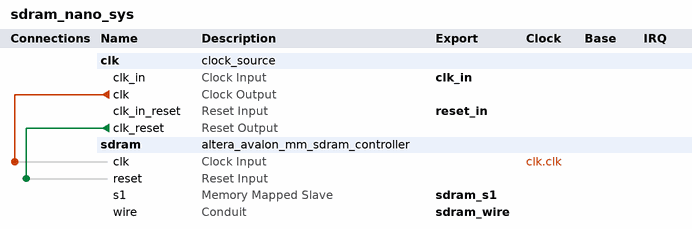
[diagram p0: system contents]
# Platform Designer (Qsys) system sdram_nano_sys, Cyclone IV E EP4CE22F17C6
# Parameters at their usual value, and those the tool derives, are not listed.
package require -exact qsys 18.1
create_system sdram_nano_sys
set_project_property DEVICE_FAMILY {Cyclone IV E}
set_project_property DEVICE EP4CE22F17C6

add_instance clk clock_source 18.1
set_instance_parameter_value clk clockFrequency 100000000
set_instance_parameter_value clk resetSynchronousEdges DEASSERT

add_instance sdram altera_avalon_mm_sdram_controller 1.0
set_instance_parameter_value sdram ADDR_MAP 0
set_instance_parameter_value sdram BANK_BITS 2
set_instance_parameter_value sdram CAS_LAT 3
set_instance_parameter_value sdram COL_BITS 9
set_instance_parameter_value sdram DATA_BITS 16
set_instance_parameter_value sdram FIFO_DEPTH 8
set_instance_parameter_value sdram INIT_REFS 8
set_instance_parameter_value sdram LOOKAHEAD 1
set_instance_parameter_value sdram RD_EXTRA_LAT 0
set_instance_parameter_value sdram REF_MAX_PEND 8
set_instance_parameter_value sdram REF_PERIOD_MS 64
set_instance_parameter_value sdram REF_ROWS 8192
set_instance_parameter_value sdram ROW_BITS 13
set_instance_parameter_value sdram SA_BITS 13
set_instance_parameter_value sdram T_INIT_US 100
set_instance_parameter_value sdram T_MRD_NS 15.0
set_instance_parameter_value sdram T_RAS_NS 45.0
set_instance_parameter_value sdram T_RCD_NS 20.0
set_instance_parameter_value sdram T_RC_NS 67.5
set_instance_parameter_value sdram T_RFC_NS 67.5
set_instance_parameter_value sdram T_RP_NS 20.0
set_instance_parameter_value sdram T_RRD_NS 14.0
set_instance_parameter_value sdram T_WR_NS 14.0
set_instance_parameter_value sdram WR_TURNAROUND_EXTRA 0

# connections
add_connection clk.clk sdram.clk clock
add_connection clk.clk_reset sdram.reset reset

# exported interfaces
add_interface clk_in clock sink
set_interface_property clk_in EXPORT_OF clk.clk_in
add_interface reset_in reset sink
set_interface_property reset_in EXPORT_OF clk.clk_in_reset
add_interface sdram_s1 avalon slave
set_interface_property sdram_s1 EXPORT_OF sdram.s1
add_interface sdram_wire conduit end
set_interface_property sdram_wire EXPORT_OF sdram.wire

set_interconnect_requirement {$system} qsys_mm.clockCrossingAdapter HANDSHAKE
set_interconnect_requirement {$system} qsys_mm.enableEccProtection FALSE
set_interconnect_requirement {$system} qsys_mm.insertDefaultSlave FALSE
set_interconnect_requirement {$system} qsys_mm.maxAdditionalLatency 1

save_system sdram_nano_sys.qsys
